# Altium schematic sheet EPS_3V3_Buck-Converter.SchDoc: 3V3 / Buck-Converter
size A4
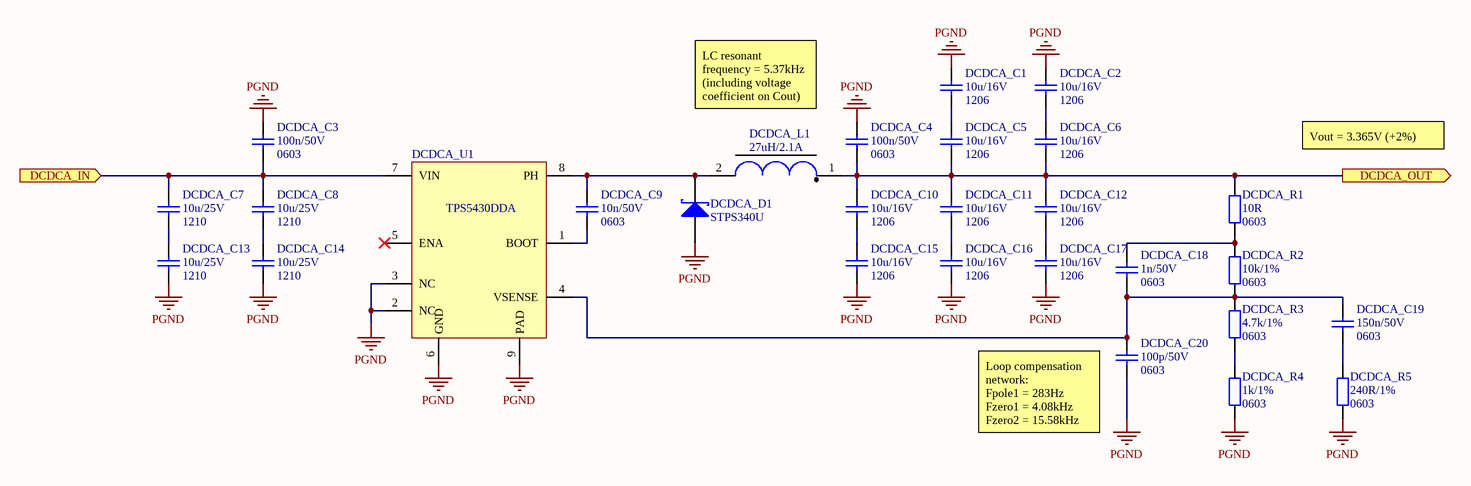
[diagram p0: EPS_3V3_Buck-Converter.SchDoc]

## Parts
DCDCA_C1  Packge: 1206  [SMD_Capacitor_1206]  (hidden comment: 10u/16V)
DCDCA_C2  Packge: 1206  [SMD_Capacitor_1206]  (hidden comment: 10u/16V)
DCDCA_C3  Package: 0603  [SMD_Capacitor_0603]  (hidden comment: 100n/50V)
DCDCA_C4  Package: 0603  [SMD_Capacitor_0603]  (hidden comment: 100n/50V)
DCDCA_C5  Packge: 1206  [SMD_Capacitor_1206]  (hidden comment: 10u/16V)
DCDCA_C6  Packge: 1206  [SMD_Capacitor_1206]  (hidden comment: 10u/16V)
DCDCA_C7  Package: 1210  [SMD_Capacitor_1210]  (hidden comment: 10u/25V)
DCDCA_C8  Package: 1210  [SMD_Capacitor_1210]  (hidden comment: 10u/25V)
DCDCA_C9  value 10n/50V  Package: 0603  [SMD_Capacitor_0603]  (hidden comment: Cap)
DCDCA_C10  Packge: 1206  [SMD_Capacitor_1206]  (hidden comment: 10u/16V)
DCDCA_C11  Packge: 1206  [SMD_Capacitor_1206]  (hidden comment: 10u/16V)
DCDCA_C12  Packge: 1206  [SMD_Capacitor_1206]  (hidden comment: 10u/16V)
DCDCA_C13  Package: 1210  [SMD_Capacitor_1210]  (hidden comment: 10u/25V)
DCDCA_C14  Package: 1210  [SMD_Capacitor_1210]  (hidden comment: 10u/25V)
DCDCA_C15  Packge: 1206  [SMD_Capacitor_1206]  (hidden comment: 10u/16V)
DCDCA_C16  Packge: 1206  [SMD_Capacitor_1206]  (hidden comment: 10u/16V)
DCDCA_C17  Packge: 1206  [SMD_Capacitor_1206]  (hidden comment: 10u/16V)
DCDCA_C18  value 1n/50V  Package: 0603  [SMD_Capacitor_0603]  (hidden comment: Cap)
DCDCA_C19  Package: 0603  [SMD_Capacitor_0603]  (hidden comment: 150n/50V)
DCDCA_C20  value 100p/50V  Package: 0603  [SMD_Capacitor_0603]  (hidden comment: Cap)
DCDCA_D1  STPS340U  [DO-214AA]
DCDCA_L1  27uH/2.1A  [Coilcraft_MSS1260]
DCDCA_R1  Package: 0603  [SMD_Resistor_0603]  (hidden comment: 10R)
DCDCA_R2  Package: 0603  [SMD_Resistor_0603]  (hidden comment: 10k/1%)
DCDCA_R3  Package: 0603  [SMD_Resistor_0603]  (hidden comment: 4.7k/1%)
DCDCA_R4  Package: 0603  [SMD_Resistor_0603]  (hidden comment: 1k/1%)
DCDCA_R5  Package: 0603  [SMD_Resistor_0603]  (hidden comment: 240R/1%)
DCDCA_U1  TPS5430DDA  [DDA-9]

## Ports
DCDCA_IN (in), DCDCA_OUT (out)

## Nets
PGND: DCDCA_C1.1 DCDCA_C2.1 DCDCA_C3.2 DCDCA_C4.2 DCDCA_C13.2 DCDCA_C14.2 DCDCA_C15.2 DCDCA_C16.2 DCDCA_C17.2 DCDCA_C20.2 DCDCA_D1.A DCDCA_R4.1 DCDCA_R5.1 DCDCA_U1.2(NC) DCDCA_U1.3(NC) DCDCA_U1.6(GND) DCDCA_U1.9(PAD)
DCDCA_IN: DCDCA_C3.1 DCDCA_C7.1 DCDCA_C8.1 DCDCA_U1.7(VIN) ; port DCDCA_IN
DCDCA_OUT: DCDCA_C4.1 DCDCA_C5.2 DCDCA_C6.2 DCDCA_C10.1 DCDCA_C11.1 DCDCA_C12.1 DCDCA_L1.1 DCDCA_R1.2 ; port DCDCA_OUT
NetDCDCA_C1_2: DCDCA_C1.2 DCDCA_C5.1
NetDCDCA_C2_2: DCDCA_C2.2 DCDCA_C6.1
NetDCDCA_C7_2: DCDCA_C7.2 DCDCA_C13.1
NetDCDCA_C8_2: DCDCA_C8.2 DCDCA_C14.1
NetDCDCA_C9_1: DCDCA_C9.1 DCDCA_D1.K DCDCA_L1.2 DCDCA_U1.8(PH)
NetDCDCA_C9_2: DCDCA_C9.2 DCDCA_U1.1(BOOT)
NetDCDCA_C10_2: DCDCA_C10.2 DCDCA_C15.1
NetDCDCA_C11_2: DCDCA_C11.2 DCDCA_C16.1
NetDCDCA_C12_2: DCDCA_C12.2 DCDCA_C17.1
NetDCDCA_C18_1: DCDCA_C18.1 DCDCA_R1.1 DCDCA_R2.2
NetDCDCA_C18_2: DCDCA_C18.2 DCDCA_C19.1 DCDCA_C20.1 DCDCA_R2.1 DCDCA_R3.2 DCDCA_U1.4(VSENSE)
NetDCDCA_C19_2: DCDCA_C19.2 DCDCA_R5.2
NetDCDCA_R3_1: DCDCA_R3.1 DCDCA_R4.2

Not connected (* = marked no-connect by the designer): DCDCA_U1 5(ENA)*

## Notes on the sheet
- LC resonant frequency = 5.37kHz (including voltage coefficient on Cout)
- Vout = 3.365V (+2%)
- (near DCDCA_C20) Loop compensation network:
  Fpole1 = 283Hz
  Fzero1 = 4.08kHz
  Fzero2 = 15.58kHz
- Title:
- Project:
- Author:
- Model:
- Document Number:
- Checked by:
- Rev:
- Date:
- Approved by:
- Sheet:
- of
- File name:

## Library data of the parts
DCDCA_C1 DCDCA_C2 DCDCA_C5 DCDCA_C6 DCDCA_C10-DCDCA_C12 DCDCA_C15-DCDCA_C17 = Cer_C1206T106K4RACTU: Ceramic Cap Kemet COTS 10u/16V X7R 1206; ManufacturerPartNumber: C1206T106K4RACTU; Manufacturer: Kemet; Value: 10u/16V
DCDCA_C3 DCDCA_C4 = Cer_GCJ188R71H104KA12D: Ceramic Cap Murata Automotive 100n/50V X7R 0603; Manufacturer: Murata; ManufacturerPartNumber: GCJ188R71H104KA12D; Value: 100n/50V
DCDCA_C7 DCDCA_C8 DCDCA_C13 DCDCA_C14 = Cer_GCJ32ER71E106KA12L: Ceramic Cap Murata Automotive 10u/25V X7R 1210; Manufacturer: Murata; ManufacturerPartNumber: GCJ32ER71E106KA12L; Value: 10u/25V
DCDCA_C19 = Cer_GCM188R71H154KA64D: Ceramic Cap Murata Automotive 150n/50V X7R 0603; Manufacturer: Murata; ManufacturerPartNumber: GCM188R71H154KA64D; Value: 150n/50V
DCDCA_D1 = STPS340x: 3A/40V Power Schottky Rectifier.; Manufacturer: STMicroelectronics; Value: STPS340U
DCDCA_L1 = MSS1260-273MLx: Coilcraft MSS1260 Inductor, L=27uH, Irise20deg=2.1A, ESR=50mR, SRF=13MHz.; Manufacturer: Coilcraft; ManufacturerPartNumber: MSS1260-273MLx; Value: 27uH/2.1A
DCDCA_R1-DCDCA_R5 = Res
  DCDCA_R1: Value: 10R
  DCDCA_R2: Value: 10k/1%
  DCDCA_R3: Value: 4.7k/1%
  DCDCA_R4: Value: 1k/1%
  DCDCA_R5: Value: 240R/1%
DCDCA_U1 = TPS5430: TPS5430 3-A, Wide Input Range, Step-Down Converter; Manufacturer: Texas Instruments; Value: TPS5430DDA